# Altium project frm-voltrod.PrjPCB
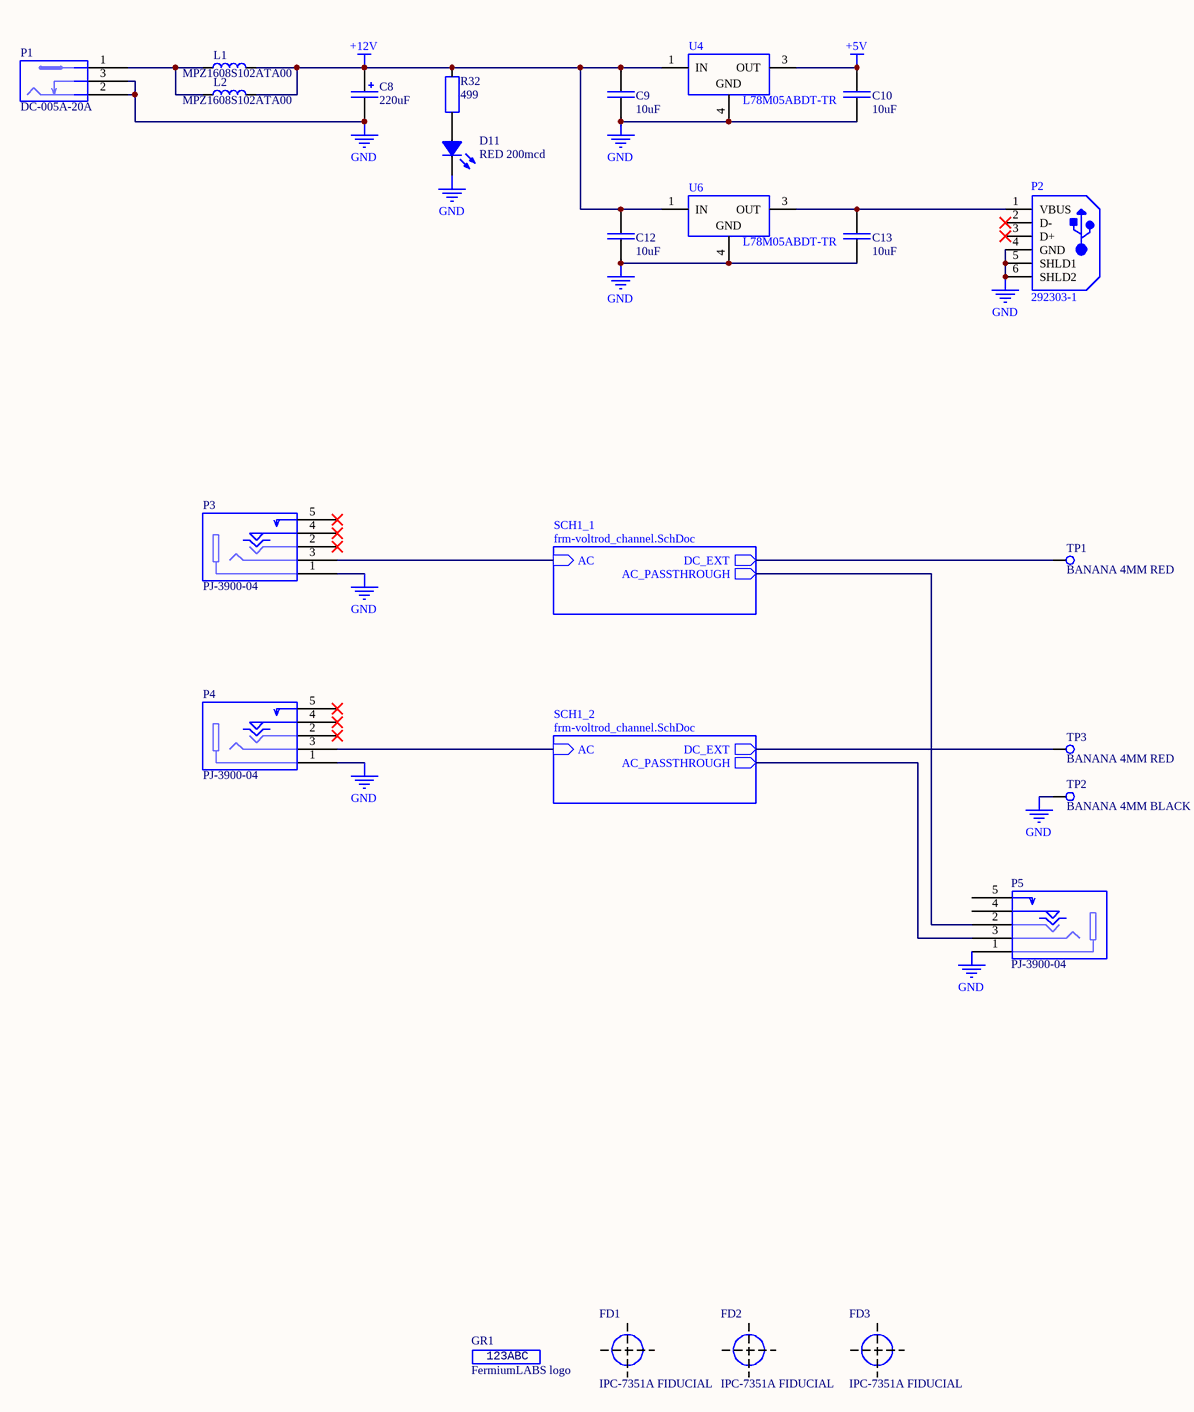
[diagram p0: frm-voltrod_main.SchDoc]
ProjectTitle: FRM-VOLTROD
4 sheets, 237 parts. Net scope: hierarchical (ports join the sheet entries above them; power ports are global).
Board file: frm-voltrod.PcbDoc
Sheets:
  frm-voltrod_main.SchDoc
    SCH1_1 = frm-voltrod_channel.SchDoc
      SCH3_1 = frm-voltrod_4LED.SchDoc
      SCH2 = frm-voltrod_AFE.SchDoc
      SCH3_2 = frm-voltrod_4LED.SchDoc
      SCH3_3 = frm-voltrod_4LED.SchDoc
      SCH3_4 = frm-voltrod_4LED.SchDoc
      SCH3_5 = frm-voltrod_4LED.SchDoc
    SCH1_2 = frm-voltrod_channel.SchDoc
      SCH3_1 = frm-voltrod_4LED.SchDoc
      SCH2 = frm-voltrod_AFE.SchDoc
      SCH3_2 = frm-voltrod_4LED.SchDoc
      SCH3_3 = frm-voltrod_4LED.SchDoc
      SCH3_4 = frm-voltrod_4LED.SchDoc
      SCH3_5 = frm-voltrod_4LED.SchDoc

## Sheet frm-voltrod_main.SchDoc: MAIN
size A3; Organization: Altium Limited; Address1: L3, 12a Rodborough Rd; Address2: Frenchs Forest; Address3: NSW; Address4: Australia 2086; DocumentNumber: 1; SheetNumber: 1; SheetTotal: 4

### Parts
C8  220uF  [3924B366-8672-45E9-B0BE-62DACC24E783]
C9  10uF  [CAP 0805_2012]
C10  10uF  [CAP 0805_2012]
C12  10uF  [CAP 0805_2012]
C13  10uF  [CAP 0805_2012]
D11  RED 200mcd  [ED49B4F6-595F-4D62-96BB-D7184CAA9B94]
FD1  IPC-7351A FIDUCIAL  [FIDUCIAL-IPC-7351A]  (no BOM)
FD2  IPC-7351A FIDUCIAL  [FIDUCIAL-IPC-7351A]  (no BOM)
FD3  IPC-7351A FIDUCIAL  [FIDUCIAL-IPC-7351A]  (no BOM)
GR1  FermiumLABS logo  [5394DE47-A0E8-4329-8464-7791B7C19310]  (no BOM)
L1  MPZ1608S102ATA00  [FER 0603_1608]
L2  MPZ1608S102ATA00  [FER 0603_1608]
P1  DC-005A-20A  [F0972D8A-C5C0-4A84-836D-A9666EE65C2D]
P2  292303-1  [8A51F738-712D-4EE5-9D6B-BB16603F834E]
P3  PJ-3900-04  [7EF2B92C-0FC9-4C85-B662-5CEC65BFCCC4]
P4  PJ-3900-04  [7EF2B92C-0FC9-4C85-B662-5CEC65BFCCC4]
P5  PJ-3900-04  [7EF2B92C-0FC9-4C85-B662-5CEC65BFCCC4]
R32  499  [RES 1206_3216]
TP1  BANANA 4MM RED  [2382AA2C-2335-4562-94C7-3B9045982126]  (no BOM)
TP2  BANANA 4MM BLACK  [2382AA2C-2335-4562-94C7-3B9045982126]  (no BOM)
TP3  BANANA 4MM RED  [2382AA2C-2335-4562-94C7-3B9045982126]  (no BOM)
U4  L78M05ABDT-TR  [4BDA507D-BB70-4009-B963-85AD90086B51]
U6  L78M05ABDT-TR  [4BDA507D-BB70-4009-B963-85AD90086B51]

### Sub-sheets
SCH1_1 = frm-voltrod_channel.SchDoc: AC (in), DC_EXT (out), AC_PASSTHROUGH (out)
SCH1_2 = frm-voltrod_channel.SchDoc: AC (in), DC_EXT (out), AC_PASSTHROUGH (out)

### Nets
+5V: C10.1 U4.3(OUT)
+12V: C8.1 C9.1 C12.1 L1.2 L2.2 R32.2 U4.1(IN) U6.1(IN)
GND: C8.2 C9.2 C10.2 C12.2 C13.2 D11.1(K) P1.2 P1.3 P2.4(GND) P2.5(SHLD1) P2.6(SHLD2) P3.1(GND) P4.1(GND) P5.1(GND) TP2.1(TP) U4.4(GND) U6.4(GND)
NetC7A_2: P5.2(R) ; sheet SCH1_1/AC_PASSTHROUGH
NetC7B_2: P5.3(L) ; sheet SCH1_2/AC_PASSTHROUGH
NetC13_1: C13.1 P2.1(VBUS) U6.3(OUT)
NetD8A_1: TP1.1(TP) ; sheet SCH1_1/DC_EXT
NetD8B_1: TP3.1(TP) ; sheet SCH1_2/DC_EXT
NetD11_2: D11.2(A) R32.1
NetL1_1: L1.1 L2.1 P1.1
NetP3_3: P3.3(L) ; sheet SCH1_1/AC
NetP4_3: P4.3(L) ; sheet SCH1_2/AC

Not connected (* = marked no-connect by the designer): P2 2(D-)* 3(D+)*; P3 2(R)* 4(AUX)* 5(AUX)*; P4 2(R)* 4(AUX)* 5(AUX)*; P5 4(AUX) 5(AUX)

### Notes on the sheet
- Title
- Fermium LABS srl
- Size:
- Date:
- File:
- A4
- Prj
- Time:
- Sheet
- of
- Via Monselice 15a
- 35142 Padova PD
- Italy
- Git Hash:
- (in symbol 50f8ea88-0034-49fe-a263-d8e97bc35e2f) 123ABC

### Library data of the parts
C8 = 1a28df19-6d3e-4a71-836c-f22920f8e8ab: CAP  THT ELEC 220uF 25V 20%; Manufacturer 1: Rubycon; Manufacturer Part Number 1: 25PK220MEFC-6.3*11; id: 14782; S 1: LCSC; SPN 1: C109337; Part Number: 1a28df19-6d3e-4a71-836c-f22920f8e8ab; ComponentLink1Description: Datasheet; ComponentLink1URL: http://localhost:8080/static/files/Rubycon-220uF-25V_C109337_12019-03-10_214953.757848.pdf?Rubycon-220uF-25V_C109337 (1).pdf; Value: 220uF
C9 C10 C12 C13 = 1ffbe5a9-0884-4740-bdad-20a6a98400e6: CAP SMD MLCC 10uF 25V 0805 X5R; Manufacturer 1: Samsung Electro-Mechanics; Manufacturer Part Number 1: CL21A106KAYNNNE; id: 14779; S 1: LCSC; SPN 1: C84416; SPN 2: C15850; Part Number: 1ffbe5a9-0884-4740-bdad-20a6a98400e6; ComponentLink1Description: Datasheet; ComponentLink1URL: http://localhost:8080/static/files/Samsung-Electro-Mechanics-CL21A106KAYNNNE_C158502019-03-10_213827.610739.pdf?Samsung-Electro-Mechanics-CL21A106KAYNNNE_C15850.pdf; Manufacturer 2: Murata; Manufacturer Part Number 2: GRM21BR61E106KA73L; S 2: LCSC; Value: 10uF
D11 = c65ae3d2-9539-4634-8979-616a331b7494: DIODE LED THT 5MM RED 200mcd; Manufacturer 1: Everlight; Manufacturer Part Number 1: 333-2SURD/S530-A3-L; id: 14851; S 1: LCSC; SPN 1: C99758; Part Number: c65ae3d2-9539-4634-8979-616a331b7494; ComponentLink1Description: Datasheet; ComponentLink1URL: http://localhost:8080/static/files/Everlight-Elec-333-2SURD-S530-A3-L_C997582019-08-18_181624.501044.pdf?Everlight-Elec-333-2SURD-S530-A3-L_C99758.pdf; Value: RED 200mcd
FD1-FD3 = 19da4612-eb95-43bb-9984-553a52b2a224: GRAPHICS FIDUCIAL IPC-7351A; id: 14800; Part Number: 19da4612-eb95-43bb-9984-553a52b2a224
GR1 = 50f8ea88-0034-49fe-a263-d8e97bc35e2f: GRAPHICS LOGO FERMIUM LABS SRL; id: 14799; Part Number: 50f8ea88-0034-49fe-a263-d8e97bc35e2f
L1 L2 = a4b2e015-bf25-47b8-954c-a5b040744a3a: FER SMD CHIP 0603 800mA 1K@100MHz 300mOhm; Manufacturer 1: TDK; id: 14850; S 1: LCSC; SPN 1: C76814; Part Number: a4b2e015-bf25-47b8-954c-a5b040744a3a; ComponentLink1Description: Datasheet; ComponentLink1URL: http://localhost:8080/static/files/TDK-MPZ1608S102ATA00_C768142019-08-18_021255.210641.pdf?TDK-MPZ1608S102ATA00_C76814.pdf; Manufacturer Part Number 1: MPZ1608S102ATA00
P1 = b53db51a-1725-412b-9039-fa7a45c7c438: CONN THT DC JACK 0.5A 30VDC 5Kcycles; Manufacturer 1: HRO Electronics; id: 14780; S 1: LCSC; SPN 1: C191049; Part Number: b53db51a-1725-412b-9039-fa7a45c7c438; ComponentLink1Description: Datasheet; ComponentLink1URL: http://localhost:8080/static/files/Korean-Hroparts-Elec-DC-005A-20A_C191049_22019-03-10_214231.486078.pdf?Korean-Hroparts-Elec-DC-005A-20A_C191049 (2).pdf; Manufacturer Part Number 1: DC-005A-20A
P2 = 9ff2a560-e541-4da0-adda-013cc9c65511: CONN THT USB TYPE-A HIGH RELIABILITY; Manufacturer 1: TE Connectivity; id: 14855; S 1: LCSC; SPN 1: C86461; Part Number: 9ff2a560-e541-4da0-adda-013cc9c65511; ComponentLink1Description: Datasheet; ComponentLink1URL: http://localhost:8080/static/files/TE_Connectivity-292303-1-datasheet2019-08-25_172711.777436.pdf?TE_Connectivity-292303-1-datasheet.pdf; Manufacturer Part Number 1: 292303-1
P3-P5 = 80507a24-5d7c-4cf5-953e-f54832d54564: CONN THT 3.5mm AUDIO STEREO AUX SWITCH; Manufacturer 1: HRO Electronics; id: 14793; S 1: LCSC; SPN 1: C151839; Part Number: 80507a24-5d7c-4cf5-953e-f54832d54564; ComponentLink1Description: Datasheet; ComponentLink1URL: http://localhost:8080/static/files/Korean-Hroparts-Elec-PJ-3900-04_C1518392019-04-10_231144.687617.pdf?Korean-Hroparts-Elec-PJ-3900-04_C151839.pdf; Manufacturer Part Number 1: PJ-3900-04
R32 = c8bf8de8-3430-48dd-94ac-a027709c0c4f: RES SMD 499 OHM 1% 1/4W 1206; Manufacturer 1: Yageo; Manufacturer Part Number 1: RC1206FR-07499RL; id: 14010; S 1: LCSC; SPN 1: C137267; Part Number: c8bf8de8-3430-48dd-94ac-a027709c0c4f; Value: 499
TP1 TP3 = 3b84d3c9-1de5-4004-b768-3958a778153b: CONN BANANA SOCKET 4MM RED; Manufacturer 1: Changzhou Amass Elec; Manufacturer Part Number 1: 24.247.1; id: 14826; S 1: LCSC; SPN 1: C106273; Part Number: 3b84d3c9-1de5-4004-b768-3958a778153b; ComponentLink1Description: Datasheet; ComponentLink1URL: http://localhost:8080/static/files/Changzhou-Amass-Elec-24-247-1_C1062732019-08-09_175257.693472.pdf?Changzhou-Amass-Elec-24-247-1_C106273.pdf
TP2 = 80ef162c-aaff-440a-80ad-5900ce15f9c1: CONN BANANA SOCKET 4MM BLACK; Manufacturer 1: Changzhou Amass Elec; Manufacturer Part Number 1: 24.247.2; id: 14827; S 1: LCSC; SPN 1: C106272; Part Number: 80ef162c-aaff-440a-80ad-5900ce15f9c1
U4 U6 = 446536aa-1bdd-4764-8cae-49f4e0c126ff: IC SMD LINEAR VOLTAGE REGULATOR 5V 500mA DPAK/TO-252; Manufacturer 1: ST Microelectronics; id: 14848; S 1: LCSC; SPN 1: C58069; Part Number: 446536aa-1bdd-4764-8cae-49f4e0c126ff; ComponentLink1Description: Datasheet; ComponentLink1URL: http://localhost:8080/static/files/STMicroelectronics-L78M05ABDT-TR_C580692019-08-17_184424.026041.pdf?STMicroelectronics-L78M05ABDT-TR_C58069.pdf; Manufacturer Part Number 1: L78M05ABDT-TR

## Sheet frm-voltrod_channel.SchDoc: SINGLE CHANNEL
size A3; Organization: Altium Limited; Address1: L3, 12a Rodborough Rd; Address2: Frenchs Forest; Address3: NSW; Address4: Australia 2086; DocumentNumber: 2; SheetNumber: 2; SheetTotal: 4
Used 2 times, as channels SCH1_1, SCH1_2. Parts and nets are listed once, with the designators drawn on the sheet.
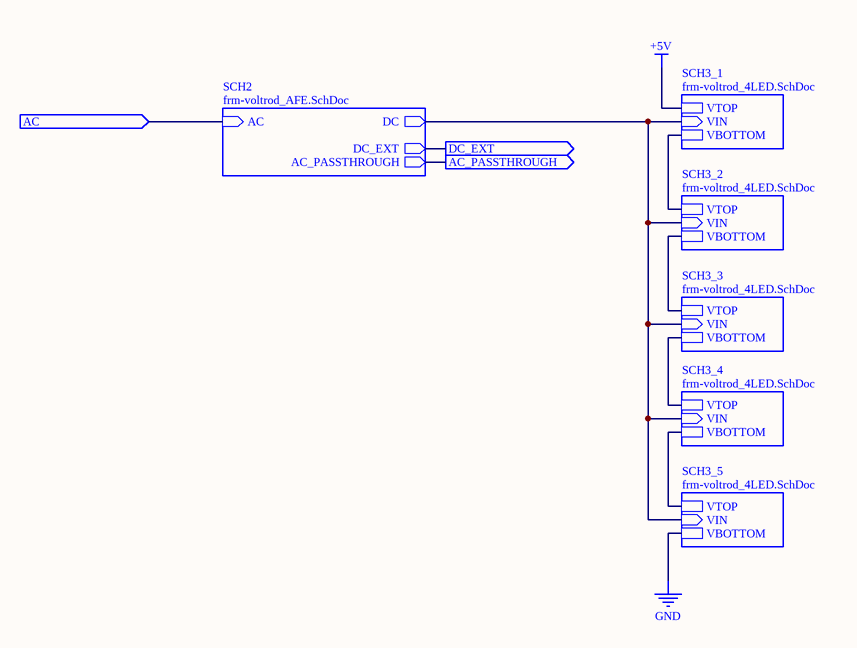
[diagram p1: frm-voltrod_channel.SchDoc]

### Sub-sheets
SCH2 = frm-voltrod_AFE.SchDoc: DC (out), AC_PASSTHROUGH (out), DC_EXT (out), AC (in)
SCH3_1 = frm-voltrod_4LED.SchDoc: VTOP, VBOTTOM, VIN (in)
SCH3_2 = frm-voltrod_4LED.SchDoc: VTOP, VBOTTOM, VIN (in)
SCH3_3 = frm-voltrod_4LED.SchDoc: VTOP, VBOTTOM, VIN (in)
SCH3_4 = frm-voltrod_4LED.SchDoc: VTOP, VBOTTOM, VIN (in)
SCH3_5 = frm-voltrod_4LED.SchDoc: VTOP, VBOTTOM, VIN (in)

### Ports
AC (in), AC_PASSTHROUGH (out), DC_EXT (out)

### Nets
AC: port AC, sheet SCH2/AC
AC_PASSTHROUGH: port AC_PASSTHROUGH, sheet SCH2/AC_PASSTHROUGH
DC_EXT: port DC_EXT, sheet SCH2/DC_EXT
(unnamed): sheet SCH3_1/VBOTTOM, sheet SCH3_2/VTOP
(unnamed): sheet SCH3_1/VIN, sheet SCH2/DC, sheet SCH3_2/VIN, sheet SCH3_3/VIN, sheet SCH3_4/VIN, sheet SCH3_5/VIN
(unnamed): sheet SCH3_2/VBOTTOM, sheet SCH3_3/VTOP
(unnamed): sheet SCH3_3/VBOTTOM, sheet SCH3_4/VTOP
(unnamed): sheet SCH3_4/VBOTTOM, sheet SCH3_5/VTOP

### Channels
SCH1_1: ports AC=NetP3_3 AC_PASSTHROUGH=NetC7A_2 DC_EXT=NetD8A_1
SCH1_2: ports AC=NetP4_3 AC_PASSTHROUGH=NetC7B_2 DC_EXT=NetD8B_1

### Notes on the sheet
- Title
- Fermium LABS srl
- Size:
- Date:
- File:
- A4
- Prj
- Time:
- Sheet
- of
- Via Monselice 15a
- 35142 Padova PD
- Italy
- Git Hash:

## Sheet frm-voltrod_4LED.SchDoc: 4LED COMPARATOR
size A3; Organization: Altium Limited; Address1: L3, 12a Rodborough Rd; Address2: Frenchs Forest; Address3: NSW; Address4: Australia 2086; DocumentNumber: 3; SheetNumber: 3; SheetTotal: 4
Used 10 times, as channels SCH1_1/SCH3_1, SCH1_1/SCH3_2, SCH1_1/SCH3_3, SCH1_1/SCH3_4, SCH1_1/SCH3_5, SCH1_2/SCH3_1, SCH1_2/SCH3_2, SCH1_2/SCH3_3, SCH1_2/SCH3_4, SCH1_2/SCH3_5. Parts and nets are listed once, with the designators drawn on the sheet.
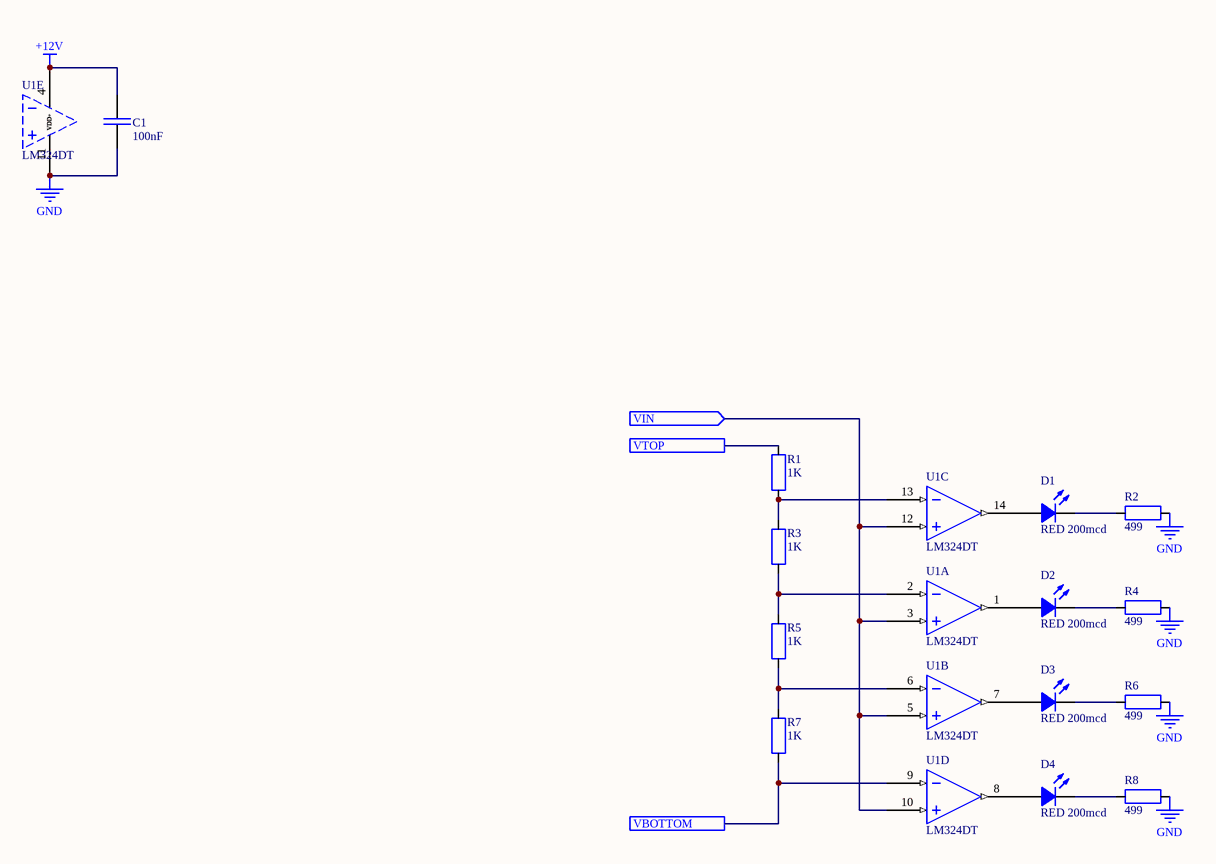
[diagram p2: frm-voltrod_4LED.SchDoc]

### Parts
C1  100nF  [CAP 0603_1608]
D1  RED 200mcd  [ED49B4F6-595F-4D62-96BB-D7184CAA9B94]
D2  RED 200mcd  [ED49B4F6-595F-4D62-96BB-D7184CAA9B94]
D3  RED 200mcd  [ED49B4F6-595F-4D62-96BB-D7184CAA9B94]
D4  RED 200mcd  [ED49B4F6-595F-4D62-96BB-D7184CAA9B94]
R1  1K  [RES 0603_1608]
R2  499  [RES 1206_3216]
R3  1K  [RES 0603_1608]
R4  499  [RES 1206_3216]
R5  1K  [RES 0603_1608]
R6  499  [RES 1206_3216]
R7  1K  [RES 0603_1608]
R8  499  [RES 1206_3216]
U1  LM324DT  [34355DA5-B1DA-47C2-A88A-ECF82120A4F7]  (parts A,B,C,D,E of 5)

### Ports
VBOTTOM, VIN (in), VTOP

### Nets
+12V: C1.1 U1.4(VDD+)
GND: C1.2 R2.2 R4.2 R6.2 R8.2 U1.11(VDD-)
VBOTTOM: R7.2 U1.9(IN-) ; port VBOTTOM
VIN: U1.3(IN+) U1.5(IN+) U1.10(IN+) U1.12(IN+) ; port VIN
VTOP: R1.1 ; port VTOP
NetD1_1: D1.1(K) R2.1
NetD1_2: D1.2(A) U1.14(OUT)
NetD2_1: D2.1(K) R4.1
NetD2_2: D2.2(A) U1.1(OUT)
NetD3_1: D3.1(K) R6.1
NetD3_2: D3.2(A) U1.7(OUT)
NetD4_1: D4.1(K) R8.1
NetD4_2: D4.2(A) U1.8(OUT)
NetR1_2: R1.2 R3.1 U1.13(IN-)
NetR3_2: R3.2 R5.1 U1.2(IN-)
NetR5_2: R5.2 R7.1 U1.6(IN-)

### Channels
SCH1_1/SCH3_1: designators end in A; ports VBOTTOM=NetR1B_1 VIN=NetU1A_3 VTOP=+5V
SCH1_1/SCH3_2: designators end in B; ports VBOTTOM=NetR1C_1 VIN=NetU1A_3 VTOP=NetR1B_1
SCH1_1/SCH3_3: designators end in C; ports VBOTTOM=NetR1D_1 VIN=NetU1A_3 VTOP=NetR1C_1
SCH1_1/SCH3_4: designators end in D; ports VBOTTOM=NetR1E_1 VIN=NetU1A_3 VTOP=NetR1D_1
SCH1_1/SCH3_5: designators end in E; ports VBOTTOM=GND VIN=NetU1A_3 VTOP=NetR1E_1
SCH1_2/SCH3_1: designators end in F; ports VBOTTOM=NetR1G_1 VIN=NetU1F_3 VTOP=+5V
SCH1_2/SCH3_2: designators end in G; ports VBOTTOM=NetR1H_1 VIN=NetU1F_3 VTOP=NetR1G_1
SCH1_2/SCH3_3: designators end in H; ports VBOTTOM=NetR1I_1 VIN=NetU1F_3 VTOP=NetR1H_1
SCH1_2/SCH3_4: designators end in I; ports VBOTTOM=NetR1J_1 VIN=NetU1F_3 VTOP=NetR1I_1
SCH1_2/SCH3_5: designators end in J; ports VBOTTOM=GND VIN=NetU1F_3 VTOP=NetR1J_1

### Notes on the sheet
- Title
- Fermium LABS srl
- Size:
- Date:
- File:
- A4
- Prj
- Time:
- Sheet
- of
- Via Monselice 15a
- 35142 Padova PD
- Italy
- Git Hash:

### Library data of the parts
C1 = 02841f84-ac15-41b5-9e17-915f8f067828: CAP SMD MLCC 100nF 25V 0603 X7R; Manufacturer 1: Samsung Electro-Mechanics; Manufacturer Part Number 1: CL10B104KA8NNNC; id: 14784; S 1: LCSC; SPN 1: C1590; Part Number: 02841f84-ac15-41b5-9e17-915f8f067828; ComponentLink1Description: Datasheet; ComponentLink1URL: http://localhost:8080/static/files/Samsung-Electro-Mechanics-CL10B104KA8NNNC_C15902019-03-10_215548.826887.pdf?Samsung-Electro-Mechanics-CL10B104KA8NNNC_C1590.pdf; Value: 100nF
D1-D4 = c65ae3d2-9539-4634-8979-616a331b7494: as D11 on sheet frm-voltrod_main; Part Number: c65ae3d2-9539-4634-8979-616a331b7494; ComponentLink1Description: Datasheet; ComponentLink1URL: http://localhost:8080/static/files/Everlight-Elec-333-2SURD-S530-A3-L_C997582019-08-18_181624.501044.pdf?Everlight-Elec-333-2SURD-S530-A3-L_C99758.pdf; Value: RED 200mcd
R1 R3 R5 R7 = a678220f-9e9d-4863-a833-9993504f723c: RES SMD 1K OHM 1% 1/10W 0603; Manufacturer 1: Yageo; Manufacturer Part Number 1: RC0603FR-071KL; id: 14794; S 1: LCSC; SPN 1: C22548; Part Number: a678220f-9e9d-4863-a833-9993504f723c; Value: 1K
R2 R4 R6 R8 = c8bf8de8-3430-48dd-94ac-a027709c0c4f: as R32 on sheet frm-voltrod_main; Part Number: c8bf8de8-3430-48dd-94ac-a027709c0c4f; Value: 499
U1 = 21a85167-c328-42f7-a52e-365842c6dad3: IC SMD OPAMP LM324DT SO-14; Manufacturer 1: ST Microelectronics; id: 14792; S 1: LCSC; SPN 1: C71035; Part Number: 21a85167-c328-42f7-a52e-365842c6dad3; ComponentLink1Description: Datasheet; ComponentLink1URL: http://localhost:8080/static/files/STMicroelectronics-LM324DT_C710352019-04-06_191500.254110.pdf?STMicroelectronics-LM324DT_C71035.pdf; Manufacturer Part Number 1: LM324DT

## Sheet frm-voltrod_AFE.SchDoc: ANALOG FRONT END
size A3; Organization: Altium Limited; Address1: L3, 12a Rodborough Rd; Address2: Frenchs Forest; Address3: NSW; Address4: Australia 2086; DocumentNumber: 4; SheetNumber: 4; SheetTotal: 4
Used 2 times, as channels SCH1_1/SCH2, SCH1_2/SCH2. Parts and nets are listed once, with the designators drawn on the sheet.
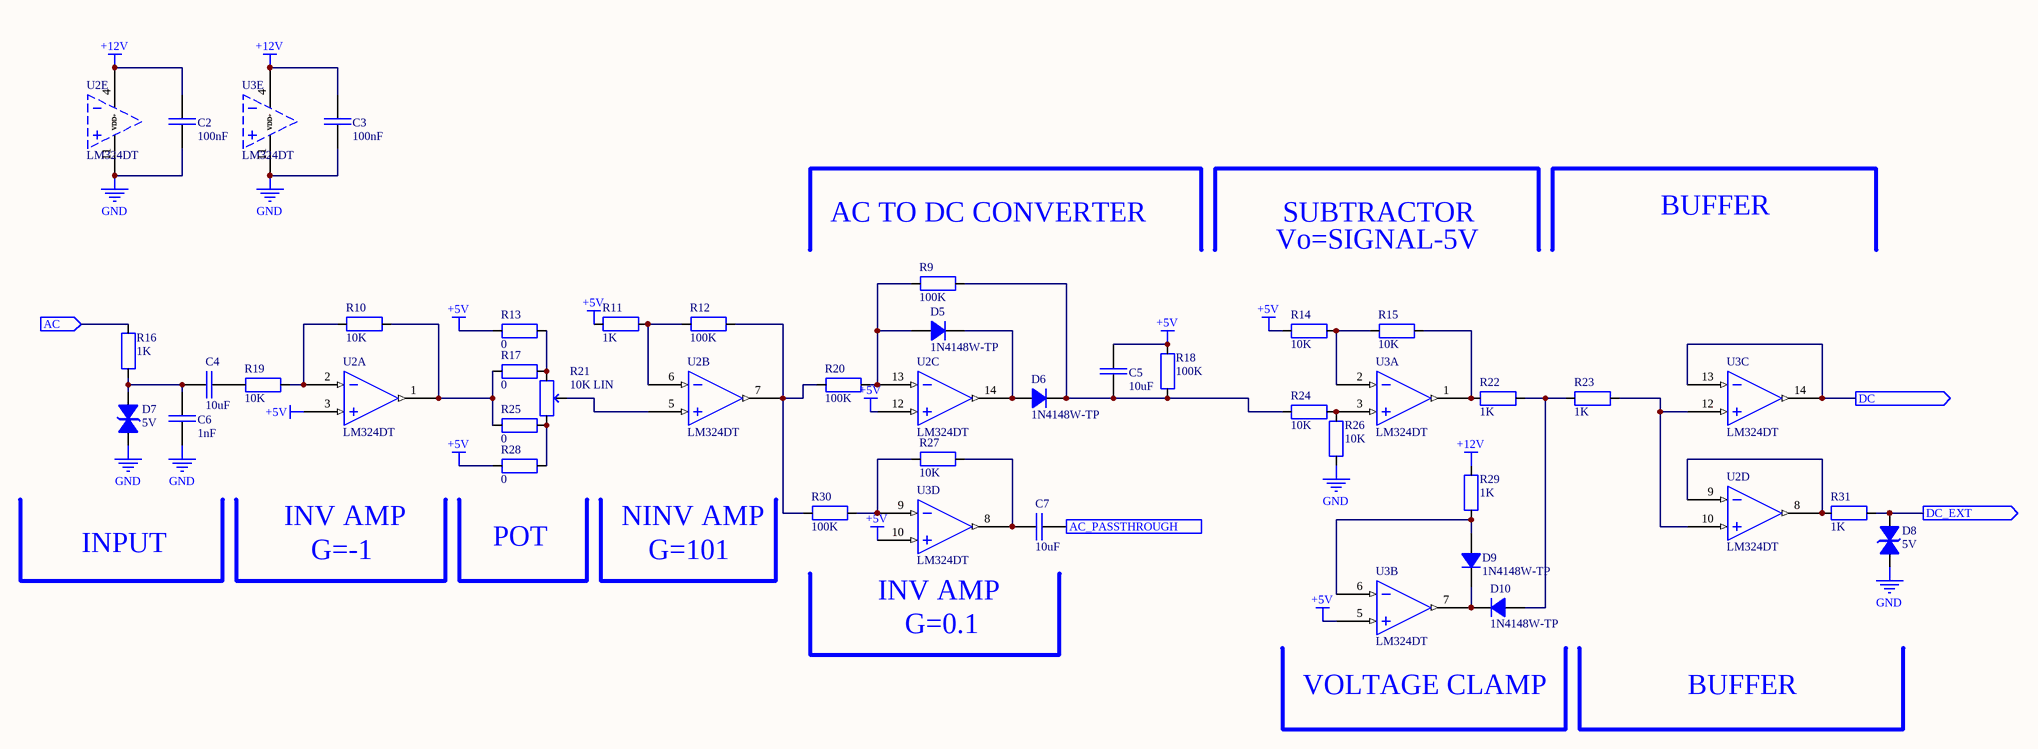
[diagram p3: frm-voltrod_AFE.SchDoc]

### Parts
C2  100nF  [CAP 0603_1608]
C3  100nF  [CAP 0603_1608]
C4  10uF  [CAP 0805_2012]
C5  10uF  [CAP 0805_2012]
C6  1nF  [CAP 0603_1608]
C7  10uF  [CAP 0805_2012]
D5  1N4148W-TP  [SOD-123]
D6  1N4148W-TP  [SOD-123]
D7  5V  [SOD523F]
D8  5V  [SOD523F]
D9  1N4148W-TP  [SOD-123]
D10  1N4148W-TP  [SOD-123]
R9  100K  [RES 0603_1608]
R10  10K  [RES 0603_1608]
R11  1K  [RES 0603_1608]
R12  100K  [RES 0603_1608]
R13  0  [RES 0603_1608]
R14  10K  [RES 0603_1608]
R15  10K  [RES 0603_1608]
R16  1K  [RES 0603_1608]
R17  0  [RES 0603_1608]
R18  100K  [RES 0603_1608]
R19  10K  [RES 0603_1608]
R20  100K  [RES 0603_1608]
R21  10K LIN  [2EF88547-EDEF-4A49-A522-C215618D4BC7]
R22  1K  [RES 0603_1608]
R23  1K  [RES 0603_1608]
R24  10K  [RES 0603_1608]
R25  0  [RES 0603_1608]
R26  10K  [RES 0603_1608]
R27  10K  [RES 0603_1608]
R28  0  [RES 0603_1608]
R29  1K  [RES 0603_1608]
R30  100K  [RES 0603_1608]
R31  1K  [RES 0603_1608]
U2  LM324DT  [34355DA5-B1DA-47C2-A88A-ECF82120A4F7]  (parts A,B,C,D,E of 5)
U3  LM324DT  [34355DA5-B1DA-47C2-A88A-ECF82120A4F7]  (parts A,B,C,D,E of 5)

### Ports
AC (in), AC_PASSTHROUGH (out), DC (out), DC_EXT (out)

### Nets
+5V: C5.2 R11.2 R13.1 R14.1 R18.1 R28.1 U2.3(IN+) U2.12(IN+) U3.5(IN+) U3.10(IN+)
+12V: C2.1 C3.1 R29.2 U2.4(VDD+) U3.4(VDD+)
GND: C2.2 C3.2 C6.2 D7.2 D8.2 R26.2 U2.11(VDD-) U3.11(VDD-)
AC: R16.2 ; port AC
AC_PASSTHROUGH: C7.2 ; port AC_PASSTHROUGH
DC: U3.13(IN-) U3.14(OUT) ; port DC
DC_EXT: D8.1 R31.1 ; port DC_EXT
NetC4_1: C4.1 C6.1 D7.1 R16.1
NetC4_2: C4.2 R19.1
NetC5_1: C5.1 D6.1(K) R9.2 R18.2 R24.1
NetC7_1: C7.1 R27.2 U3.8(OUT)
NetD5_1: D5.1(K) D6.2(A) U2.14(OUT)
NetD5_2: D5.2(A) R9.1 R20.2 U2.13(IN-)
NetD9_1: D9.1(K) D10.1(K) U3.7(OUT)
NetD9_2: D9.2(A) R29.1 U3.6(IN-)
NetD10_2: D10.2(A) R22.1 R23.2
NetR10_1: R10.1 R19.2 U2.2(IN-)
NetR10_2: R10.2 R17.1 R25.1 U2.1(OUT)
NetR11_1: R11.1 R12.1 U2.6(IN-)
NetR12_2: R12.2 R20.1 R30.1 U2.7(OUT)
NetR13_2: R13.2 R17.2 R21.1
NetR14_2: R14.2 R15.1 U3.2(IN-)
NetR15_2: R15.2 R22.2 U3.1(OUT)
NetR21_2: R21.2 U2.5(IN+)
NetR21_3: R21.3 R25.2 R28.2
NetR23_1: R23.1 U2.10(IN+) U3.12(IN+)
NetR24_2: R24.2 R26.1 U3.3(IN+)
NetR27_1: R27.1 R30.2 U3.9(IN-)
NetR31_2: R31.2 U2.8(OUT) U2.9(IN-)

### Channels
SCH1_1/SCH2: designators end in A; ports AC=NetP3_3 AC_PASSTHROUGH=NetC7A_2 DC=NetU1A_3 DC_EXT=NetD8A_1
SCH1_2/SCH2: designators end in B; ports AC=NetP4_3 AC_PASSTHROUGH=NetC7B_2 DC=NetU1F_3 DC_EXT=NetD8B_1

### Notes on the sheet
- BUFFER
- AC TO DC CONVERTER
- Vo=SIGNAL-5V
- SUBTRACTOR
- INPUT
- INV AMP
- G=-1
- POT
- NINV AMP
- G=101
- (near U3) INV AMP
- G=0.1
- VOLTAGE CLAMP
- Title
- Fermium LABS srl
- Size:
- Date:
- File:
- A4
- Prj
- Time:
- Sheet
- of
- Via Monselice 15a
- 35142 Padova PD
- Italy
- Git Hash:

### Library data of the parts
C2 C3 = 02841f84-ac15-41b5-9e17-915f8f067828: as C1 on sheet frm-voltrod_4LED; Part Number: 02841f84-ac15-41b5-9e17-915f8f067828; ComponentLink1Description: Datasheet; ComponentLink1URL: http://localhost:8080/static/files/Samsung-Electro-Mechanics-CL10B104KA8NNNC_C15902019-03-10_215548.826887.pdf?Samsung-Electro-Mechanics-CL10B104KA8NNNC_C1590.pdf; Value: 100nF
C4 C5 C7 = 1ffbe5a9-0884-4740-bdad-20a6a98400e6: as C9 on sheet frm-voltrod_main; Part Number: 1ffbe5a9-0884-4740-bdad-20a6a98400e6; ComponentLink1Description: Datasheet; ComponentLink1URL: http://localhost:8080/static/files/Samsung-Electro-Mechanics-CL21A106KAYNNNE_C158502019-03-10_213827.610739.pdf?Samsung-Electro-Mechanics-CL21A106KAYNNNE_C15850.pdf; Value: 10uF; Manufacturer 2: Murata; Manufacturer Part Number 2: GRM21BR61E106KA73L; S 2: LCSC
C6 = 0eca2548-3630-4fea-a3d5-94248c1cae74: CAP SMD MLCC 1nF 50V 0603 X7R; Manufacturer 1: Samsung Electro-Mechanics; Manufacturer Part Number 1: CL10B102KB8NNNC; id: 14785; S 1: LCSC; SPN 1: C1588; Part Number: 0eca2548-3630-4fea-a3d5-94248c1cae74; ComponentLink1Description: Datasheet; ComponentLink1URL: http://localhost:8080/static/files/Samsung-Electro-Mechanics-CL10B102KB8NNNC_C1588_12019-03-10_215732.131818.pdf?Samsung-Electro-Mechanics-CL10B102KB8NNNC_C1588 (1).pdf; Value: 1nF
D5 D6 D9 D10 = 5e920700-75df-48e3-84dd-8f9f777caed8: DIODE SMD 100V 150mA 1.5Vf SOD-123 4148; Manufacturer 1: MCC; id: 14795; S 1: LCSC; SPN 1: C77978; Part Number: 5e920700-75df-48e3-84dd-8f9f777caed8; ComponentLink1Description: Datasheet; ComponentLink1URL: http://localhost:8080/static/files/Micro-Commercial-Components-MCC-1N4148W-TP_C779782019-04-06_215019.428643.pdf?Micro-Commercial-Components-MCC-1N4148W-TP_C77978.pdf; Manufacturer Part Number 1: 1N4148W-TP
D7 D8 = daa58212-38e2-4326-a156-8e48058c46f1: DIODE SMD TVS 5V BIDIRECTIONAL SOD-523; Manufacturer 1: Born Semiconductor; Manufacturer Part Number 1: PESD5V0S1BBN; id: 14837; S 1: LCSC; SPN 1: C97640; SPN 2: C314264; Part Number: daa58212-38e2-4326-a156-8e48058c46f1; ComponentLink1Description: Datasheet; ComponentLink1URL: http://localhost:8080/static/files/Nexperia-PESD5V0S1BB-115_C976402019-08-16_201905.624024.pdf?Nexperia-PESD5V0S1BB-115_C97640.pdf; Value: 5V; ComponentLink2Description: Datasheet; ComponentLink2URL: http://localhost:8080/static/files/1901051701_Bourne-Semicon-Shenzhen-PESD5V0S1BBN_C3142642019-08-16_201911.992552.pdf?1901051701_Bourne-Semicon-Shenzhen-PESD5V0S1BBN_C314264.pdf; Manufacturer 2: Nexperia; Manufacturer Part Number 2: PESD5V0S1BB,115; S 2: LCSC
R9 R12 R18 R20 R30 = 76af10b3-9d85-4b5c-a2d6-26cc74f432f7: RES SMD 100K OHM 1% 1/10W 0603; Manufacturer 1: Yageo; Manufacturer Part Number 1: RC0603FR-07100KL; id: 12746; S 1: LCSC; SPN 1: C14675; Part Number: 76af10b3-9d85-4b5c-a2d6-26cc74f432f7; Value: 100K
R10 R14 R15 R19 R24 R26 R27 = 93242766-ba1d-462d-b58f-ce1dfc4129c8: RES SMD 10K OHM 1% 1/10W 0603; Manufacturer 1: Yageo; Manufacturer Part Number 1: RC0603FR-0710KL; id: 12101; S 1: LCSC; SPN 1: C98220; Part Number: 93242766-ba1d-462d-b58f-ce1dfc4129c8; Value: 10K
R11 R16 R22 R23 R29 R31 = a678220f-9e9d-4863-a833-9993504f723c: as R1 on sheet frm-voltrod_4LED; Part Number: a678220f-9e9d-4863-a833-9993504f723c; Value: 1K
R13 R17 R25 R28 = 6ae227f9-847f-4766-8522-e11a83531204: RES SMD 0 OHM 5% 1/10W 0603; Manufacturer 1: Yageo; Manufacturer Part Number 1: RC0603JR-070RL; id: 11973; S 1: LCSC; SPN 1: C95177; Part Number: 6ae227f9-847f-4766-8522-e11a83531204; Value: 0
R21 = 3df905ea-1e80-4add-859d-a36edd7f106c: POT 10K 20% SHAFT 6mmx7.4mm LIN; Manufacturer 1: ALPS; Manufacturer Part Number 1: RK09K1130A6S; id: 14828; S 1: LCSC; SPN 1: C209770; Part Number: 3df905ea-1e80-4add-859d-a36edd7f106c; ComponentLink1Description: 3D Model; ComponentLink1URL: http://localhost:8080/static/files/RK09K1130A6S2019-08-17_031625.830758.zip?RK09K1130A6S.zip; Value: 10K LIN; ComponentLink2Description: Datasheet; ComponentLink2URL: http://localhost:8080/static/files/ALPS-Electric-RK09K1130A6S_C2097702019-08-17_031651.036431.pdf?ALPS-Electric-RK09K1130A6S_C209770.pdf
U2 U3 = 21a85167-c328-42f7-a52e-365842c6dad3: as U1 on sheet frm-voltrod_4LED; Part Number: 21a85167-c328-42f7-a52e-365842c6dad3; ComponentLink1Description: Datasheet; ComponentLink1URL: http://localhost:8080/static/files/STMicroelectronics-LM324DT_C710352019-04-06_191500.254110.pdf?STMicroelectronics-LM324DT_C71035.pdf; Manufacturer Part Number 1: LM324DT

## Nets that join several sheets
+5V: frm-voltrod_main (C10.1 U4.3), SCH1_1/SCH3_1 (R1A.1), SCH1_1/SCH2 (10 pins), SCH1_2/SCH3_1 (R1F.1), SCH1_2/SCH2 (10 pins)
+12V: frm-voltrod_main (8 pins), SCH1_1/SCH3_1 (C1A.1 U1A.4), SCH1_1/SCH2 (5 pins), SCH1_1/SCH3_2 (C1B.1 U1B.4), SCH1_1/SCH3_3 (C1C.1 U1C.4), SCH1_1/SCH3_4 (C1D.1 U1D.4), SCH1_1/SCH3_5 (C1E.1 U1E.4), SCH1_2/SCH3_1 (C1F.1 U1F.4), SCH1_2/SCH2 (5 pins), SCH1_2/SCH3_2 (C1G.1 U1G.4), SCH1_2/SCH3_3 (C1H.1 U1H.4), SCH1_2/SCH3_4 (C1I.1 U1I.4), SCH1_2/SCH3_5 (C1J.1 U1J.4)
GND: frm-voltrod_main (17 pins), SCH1_1/SCH3_1 (6 pins), SCH1_1/SCH2 (8 pins), SCH1_1/SCH3_2 (6 pins), SCH1_1/SCH3_3 (6 pins), SCH1_1/SCH3_4 (6 pins), SCH1_1/SCH3_5 (8 pins), SCH1_2/SCH3_1 (6 pins), SCH1_2/SCH2 (8 pins), SCH1_2/SCH3_2 (6 pins), SCH1_2/SCH3_3 (6 pins), SCH1_2/SCH3_4 (6 pins), SCH1_2/SCH3_5 (8 pins)
NetC7A_2: frm-voltrod_main (P5.2), SCH1_1/SCH2 (C7A.2)
NetC7B_2: frm-voltrod_main (P5.3), SCH1_2/SCH2 (C7B.2)
NetD8A_1: frm-voltrod_main (TP1.1), SCH1_1/SCH2 (D8A.1 R31A.1)
NetD8B_1: frm-voltrod_main (TP3.1), SCH1_2/SCH2 (D8B.1 R31B.1)
NetP3_3: frm-voltrod_main (P3.3), SCH1_1/SCH2 (R16A.2)
NetP4_3: frm-voltrod_main (P4.3), SCH1_2/SCH2 (R16B.2)
NetR1B_1: SCH1_1/SCH3_1 (R7A.2 U1A.9), SCH1_1/SCH3_2 (R1B.1)
NetR1C_1: SCH1_1/SCH3_2 (R7B.2 U1B.9), SCH1_1/SCH3_3 (R1C.1)
NetR1D_1: SCH1_1/SCH3_3 (R7C.2 U1C.9), SCH1_1/SCH3_4 (R1D.1)
NetR1E_1: SCH1_1/SCH3_4 (R7D.2 U1D.9), SCH1_1/SCH3_5 (R1E.1)
NetR1G_1: SCH1_2/SCH3_1 (R7F.2 U1F.9), SCH1_2/SCH3_2 (R1G.1)
NetR1H_1: SCH1_2/SCH3_2 (R7G.2 U1G.9), SCH1_2/SCH3_3 (R1H.1)
NetR1I_1: SCH1_2/SCH3_3 (R7H.2 U1H.9), SCH1_2/SCH3_4 (R1I.1)
NetR1J_1: SCH1_2/SCH3_4 (R7I.2 U1I.9), SCH1_2/SCH3_5 (R1J.1)
NetU1A_3: SCH1_1/SCH3_1 (U1A.3 U1A.5 U1A.10 U1A.12), SCH1_1/SCH2 (U3A.13 U3A.14), SCH1_1/SCH3_2 (U1B.3 U1B.5 U1B.10 U1B.12), SCH1_1/SCH3_3 (U1C.3 U1C.5 U1C.10 U1C.12), SCH1_1/SCH3_4 (U1D.3 U1D.5 U1D.10 U1D.12), SCH1_1/SCH3_5 (U1E.3 U1E.5 U1E.10 U1E.12)
NetU1F_3: SCH1_2/SCH3_1 (U1F.3 U1F.5 U1F.10 U1F.12), SCH1_2/SCH2 (U3B.13 U3B.14), SCH1_2/SCH3_2 (U1G.3 U1G.5 U1G.10 U1G.12), SCH1_2/SCH3_3 (U1H.3 U1H.5 U1H.10 U1H.12), SCH1_2/SCH3_4 (U1I.3 U1I.5 U1I.10 U1I.12), SCH1_2/SCH3_5 (U1J.3 U1J.5 U1J.10 U1J.12)

## Assembly variants
MAIN: not fitted R13A R13B R25A R25B